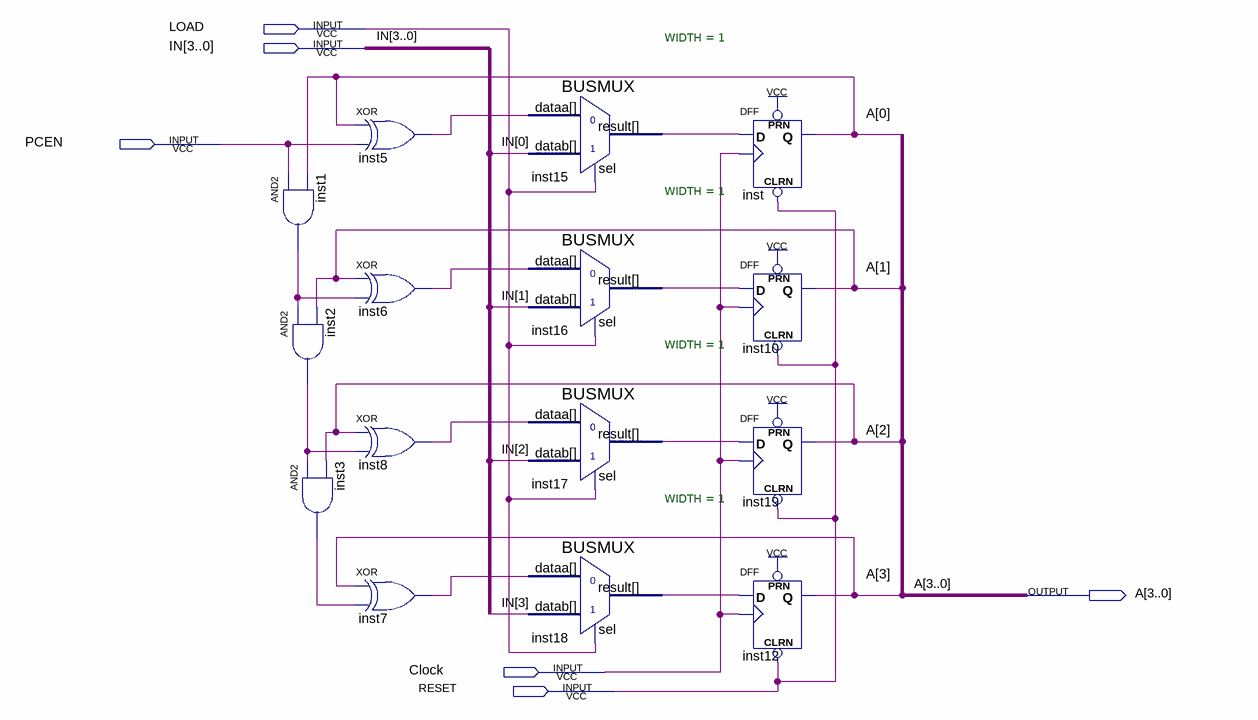
[diagram p0: schematic sheet]
// Quartus schematic PC.bdf as structural Verilog: 15 symbols, 6 pins
module PC (
  input  LOAD,
  input  [3:0] IN,
  input  PCEN,
  input  Clock,
  input  RESET,
  output [3:0] A
);

  wire inst1_out, inst2_out, inst3_out, inst5_out, inst6_out, inst7_out, inst8_out, inst15_result,
       inst16_result, inst17_result, inst18_result;

  and inst1 (inst1_out, PCEN, A[0]);
  and inst2 (inst2_out, inst1_out, A[1]);
  and inst3 (inst3_out, inst2_out, A[2]);
  xor inst5 (inst5_out, A[0], PCEN);
  xor inst6 (inst6_out, A[1], inst1_out);
  xor inst8 (inst8_out, A[2], inst2_out);
  xor inst7 (inst7_out, A[3], inst3_out);
  BUSMUX #(.WIDTH(1)) inst15 (.datab(IN[0]), .sel(LOAD), .dataa(inst5_out), .result(inst15_result));
  BUSMUX #(.WIDTH(1)) inst16 (.datab(IN[1]), .sel(LOAD), .dataa(inst6_out), .result(inst16_result));
  BUSMUX #(.WIDTH(1)) inst17 (.datab(IN[2]), .sel(LOAD), .dataa(inst8_out), .result(inst17_result));
  BUSMUX #(.WIDTH(1)) inst18 (.datab(IN[3]), .sel(LOAD), .dataa(inst7_out), .result(inst18_result));
  DFF inst (.CLRN(RESET), .CLK(Clock), .D(inst15_result), .PRN(1'b1), .Q(A[0]));
  DFF inst10 (.CLRN(RESET), .CLK(Clock), .D(inst16_result), .PRN(1'b1), .Q(A[1]));
  DFF inst19 (.CLRN(RESET), .CLK(Clock), .D(inst17_result), .PRN(1'b1), .Q(A[2]));
  DFF inst12 (.CLRN(RESET), .CLK(Clock), .D(inst18_result), .PRN(1'b1), .Q(A[3]));
endmodule
